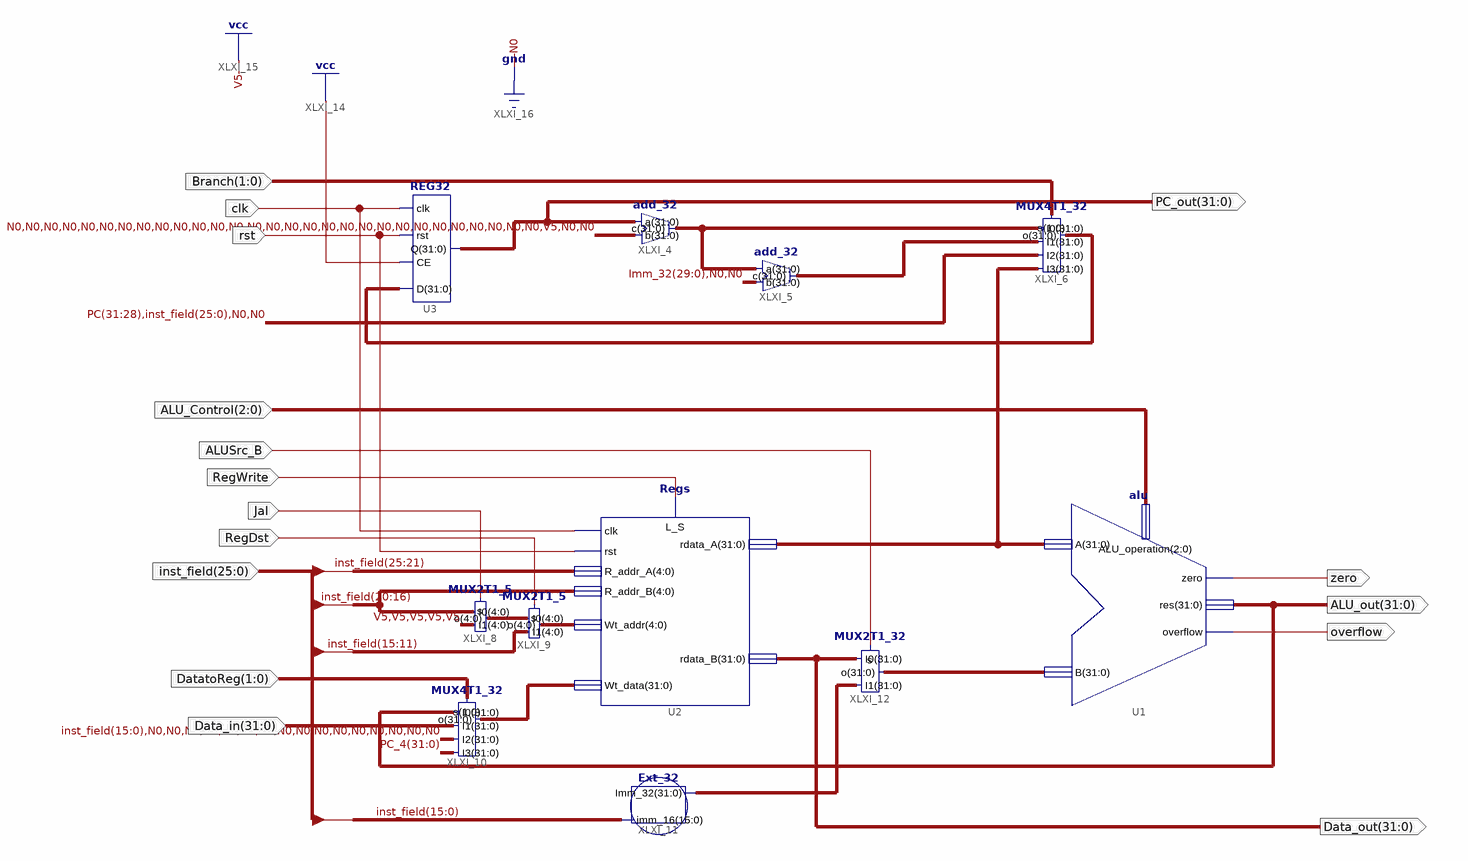
[diagram p0: schematic sheet 1]
// Xilinx ISE schematic Data_path_more.sch (kintex7) as structural Verilog: 11 symbols, 16 ports
module Data_path_more (
  input  clk,
  input  rst,
  input  [2:0] ALU_Control,
  input  ALUSrc_B,
  input  RegWrite,
  input  [31:0] Data_in,
  input  [1:0] DatatoReg,
  input  Jal,
  input  [1:0] Branch,
  input  RegDst,
  input  [25:0] inst_field,
  output [31:0] Data_out,
  output zero,
  output [31:0] ALU_out,
  output overflow,
  output [31:0] PC_out
);

  wire [4:0] XLXN_59, XLXN_64;
  wire [31:0] Imm_32, PC_4, XLXN_7, XLXN_9, XLXN_41, XLXN_43, XLXN_66;
  wire [31:28] PC;

  REG32 U3 (.D(XLXN_43), .CE(1'b1), .rst(rst), .clk(clk), .Q(PC_out));
  add_32 XLXI_4 (.c(PC_4), .a(PC_out), .b(32'b00000000000000000000000000000100));
  add_32 XLXI_5 (.c(XLXN_41), .a(PC_4), .b({Imm_32[29:0], 2'b00}));
  MUX4T1_32 XLXI_6 (.s(Branch), .I0(PC_4), .I1(XLXN_41), .I2({PC, inst_field, 2'b00}), .I3(XLXN_7), .o(XLXN_43));
  Regs U2 (
    .clk(clk), .L_S(RegWrite), .rdata_A(XLXN_7), .rst(rst), .Wt_data(XLXN_66), .rdata_B(Data_out),
    .R_addr_A(inst_field[25:21]), .R_addr_B(inst_field[20:16]), .Wt_addr(XLXN_59));
  MUX4T1_32 XLXI_10 (
    .s(DatatoReg), .I0(ALU_out), .I1(Data_in), .I2({inst_field[15:0], {16{1'b0}}}), .I3(PC_4), .o(XLXN_66));
  Ext_32 XLXI_11 (.imm_16(inst_field[15:0]), .Imm_32(Imm_32));
  MUX2T1_32 XLXI_12 (.s(ALUSrc_B), .I0(Data_out), .I1(Imm_32), .o(XLXN_9));
  alu U1 (.zero(zero), .res(ALU_out), .overflow(overflow), .A(XLXN_7), .B(XLXN_9), .ALU_operation(ALU_Control));
  MUX2T1_5 XLXI_8 (.I1({5{1'b1}}), .I0(inst_field[20:16]), .o(XLXN_64), .s(Jal));
  MUX2T1_5 XLXI_9 (.I1(inst_field[15:11]), .I0(XLXN_64), .o(XLXN_59), .s(RegDst));
endmodule
